# Altium schematic sheet arduino phc.SchDoc
size A3
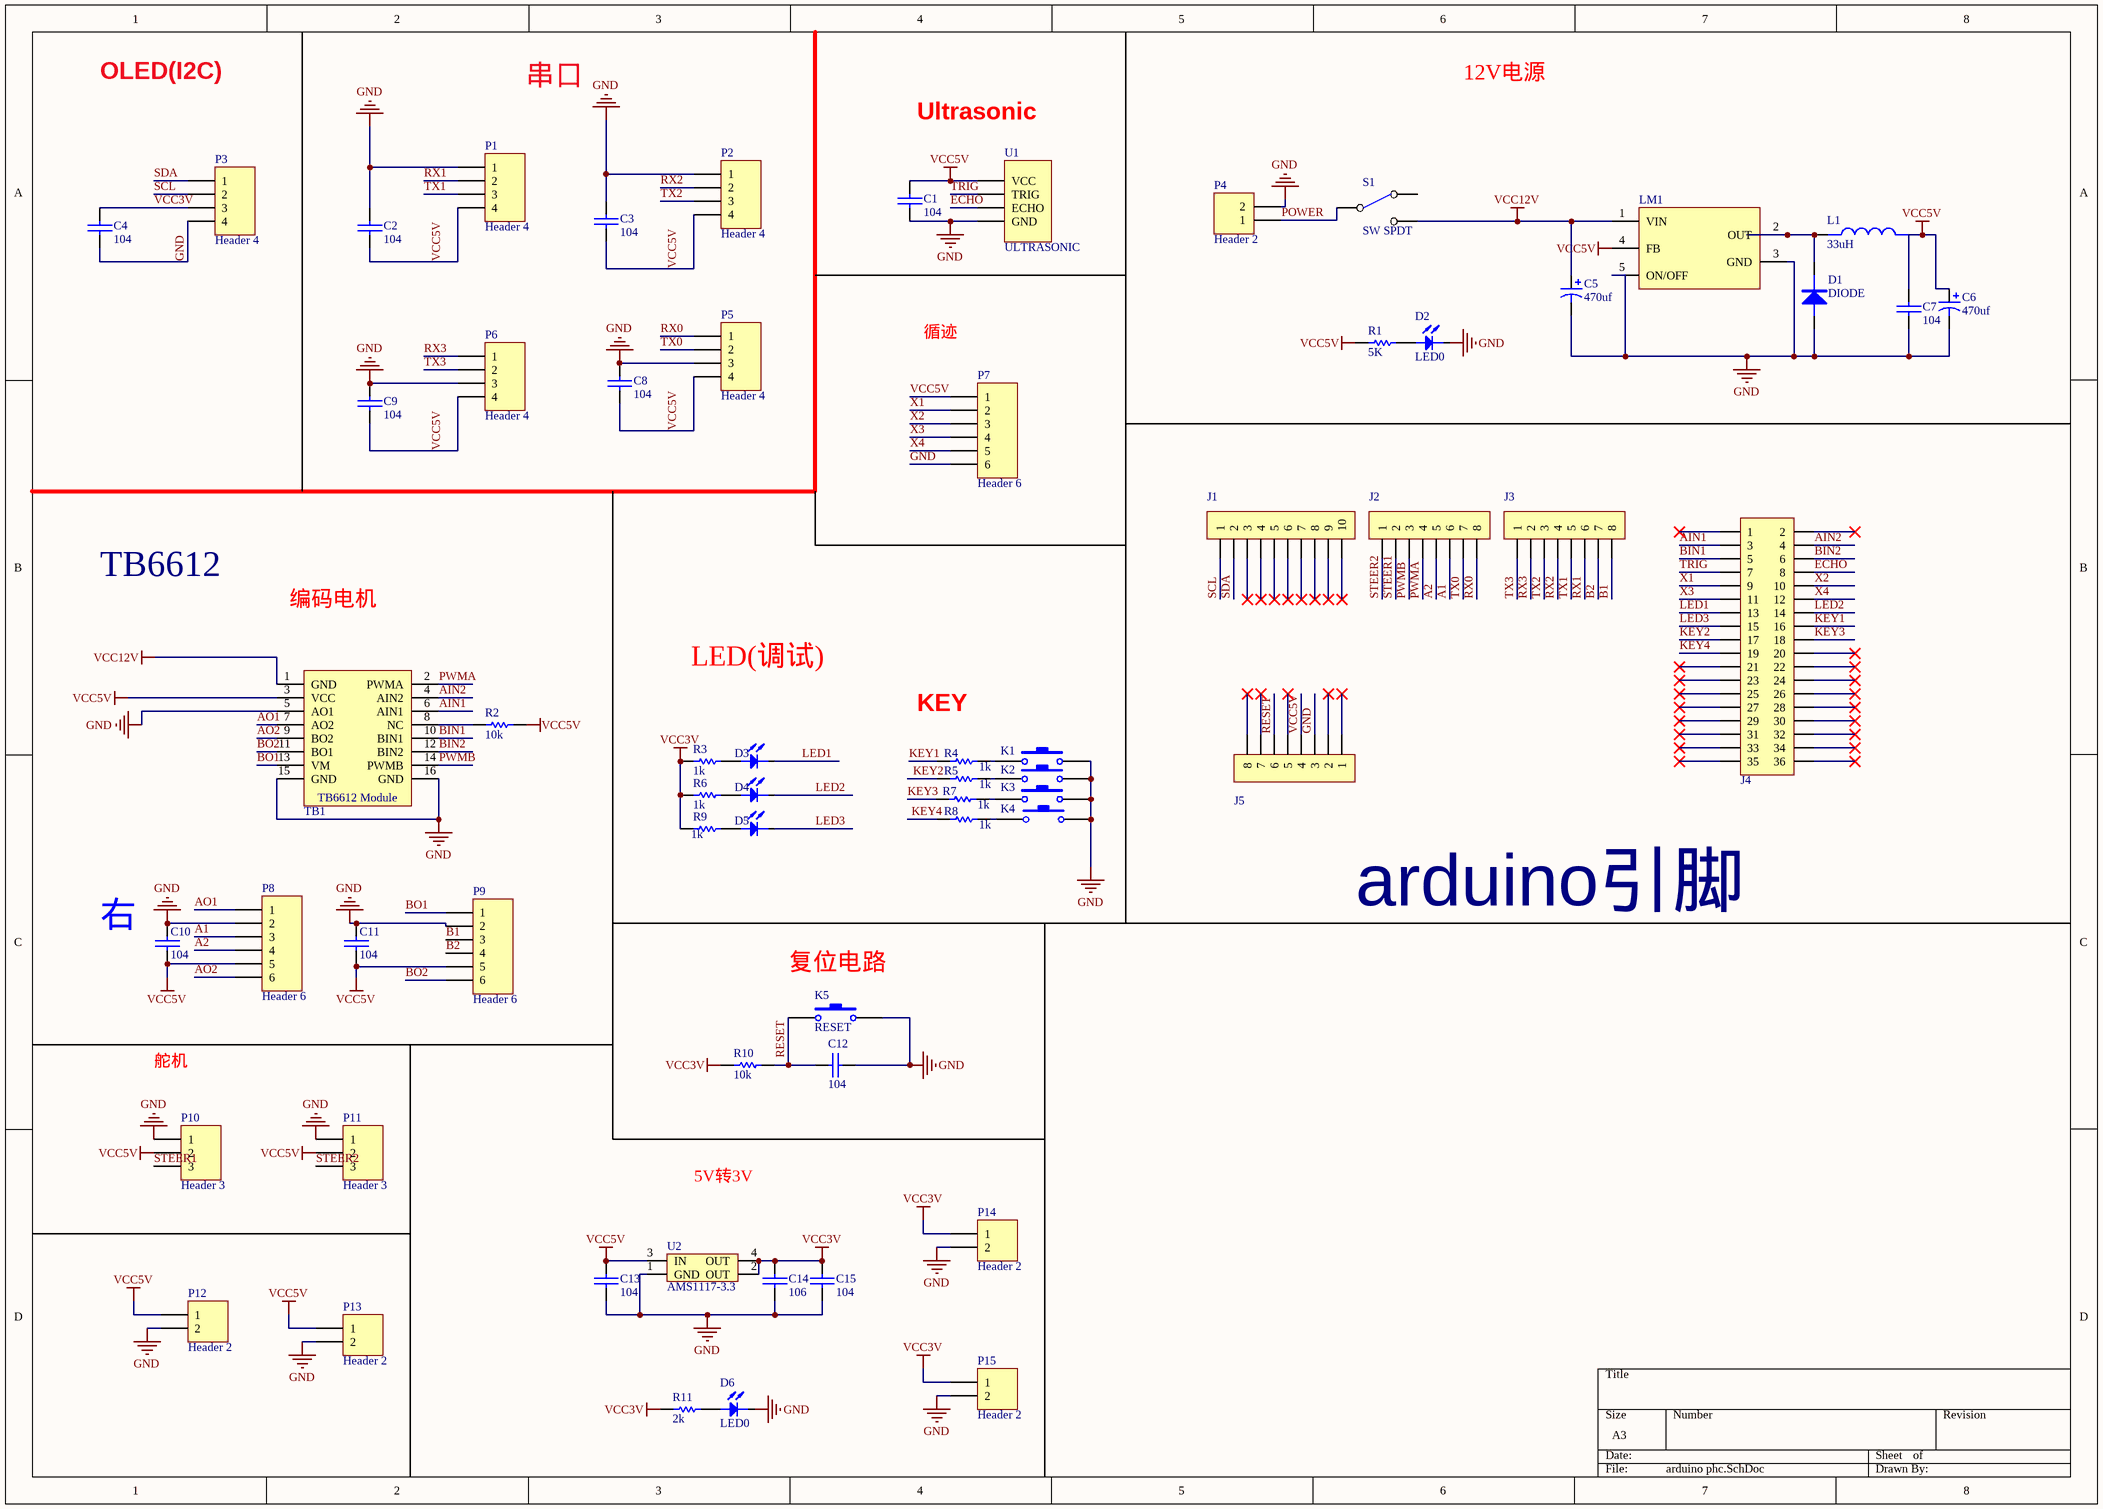
[diagram p0: arduino phc.SchDoc]

## Parts
C1  value 104  [0603_C]  (hidden comment: CAP)
C2  value 104  [0805_C]  (hidden comment: CAP)
C3  value 104  [0805_C]  (hidden comment: CAP)
C4  value 104  [0805_C]  (hidden comment: CAP)
C5  value 470uf  [CAP-8*16]  (hidden comment: CAP_HER)
C6  value 470uf  [CAP-8*16]  (hidden comment: CAP_HER)
C7  value 104  [0805_C]  (hidden comment: CAP)
C8  value 104  [0805_C]  (hidden comment: CAP)
C9  value 104  [0805_C]  (hidden comment: CAP)
C10  value 104  [0805_C]  (hidden comment: CAP)
C11  value 104  [0805_C]  (hidden comment: CAP)
C12  104  [0805_C]
C13  value 104  [0805_C]  (hidden comment: CAP)
C14  value 106  [0805_C]  (hidden comment: CAP)
C15  value 104  [0805_C]  (hidden comment: CAP)
D1  DIODE  [D1810]
D2  LED0  [0805-LED-RED]
D3  LED  [0805-LED-RED]  (value not drawn)
D4  LED  [0805-LED-RED]  (value not drawn)
D5  LED  [0805-LED-RED]  (value not drawn)
D6  LED0  [0805-LED-RED]
J1  HDR-1X10  [HDR2.54-LI-10P]  (value not drawn)
J2  HDR-1X8  [HDR2.54-LI-8P]  (value not drawn)
J3  HDR-1X8  [HDR2.54-LI-8P]  (value not drawn)
J4  Header 2X11  [HDR2.54-LI-2x18P]  (value not drawn)
J5  HDR-1X8  [HDR2.54-LI-8P]  (value not drawn)
K1  KEY2  [KEY-SMD]  (value not drawn)
K2  KEY2  [KEY-SMD]  (value not drawn)
K3  KEY3  [KEY-SMD]  (value not drawn)
K4  KEY3  [KEY-SMD]  (value not drawn)
K5  RESET  [KEY-SMD]
L1  33uH  [L_SOP74]
LM1  LM2596  [TO-263-5L]  (value not drawn)
P1  Header 4  [HDR1X4]
P2  Header 4  [HDR1X4]
P3  Header 4  [HDR1X4]
P4  Header 2  [DG1282-5.0]
P5  Header 4  [HDR1X4]
P6  Header 4  [HDR1X4]
P7  Header 6  [HDR1X6]
P8  Header 6  [XH2.54-WS-6P]
P9  Header 6  [XH2.54-WS-6P]
P10  Header 3  [HDR1X3]
P11  Header 3  [HDR1X3]
P12  Header 2  [HDR1X2]
P13  Header 2  [HDR1X2]
P14  Header 2  [HDR1X2]
P15  Header 2  [HDR1X2]
R1  5K  [0805_R]
R2  value 10k  [0805_R]  (hidden comment: RES)
R3  value 1k  [0805_R]  (hidden comment: RES)
R4  value 1k  [0805_R]  (hidden comment: RES)
R5  value 1k  [0805_R]  (hidden comment: RES)
R6  value 1k  [0805_R]  (hidden comment: RES)
R7  value 1k  [0805_R]  (hidden comment: RES)
R8  value 1k  [0805_R]  (hidden comment: RES)
R9  value 1k  [0805_R]  (hidden comment: RES)
R10  RES  [0805_R]  (value not drawn)
R11  value 2k  [0805_R]  (hidden comment: RES)
S1  SW SPDT  [SWITCH_3F_SPDT - 4.7mm]
TB1  TB6612 Module  [TB6612]  (value not drawn)
U1  ULTRASONIC  [HDR1X4]
U2  AMS1117-3.3  [SOT223_L]

## Nets
GND: C1.2 C2.1 C3.1 C4.2 C5.2 C6.2 C7.2 C8.1 C9.1 C10.1 C11.1 C12.2 C13.2 C14.2 C15.2 D1.a D2.K D6.K J5.3 K1.2 K2.2 K3.2 K4.2 K5.2 LM1.3(GND) LM1.5(ON/OFF) P1.1 P2.1 P3.4 P4.2 P5.3 P6.3 P7.6 P8.2 P9.2 P10.1 P11.1 P12.2 P13.2 P14.2 P15.2 TB1.5(AO1) TB1.15(GND) TB1.16(GND) U1.4(GND) U2.1(GND)
VCC3V: C4.1 C14.1 C15.1 P3.3 P14.1 P15.1 R3.1(BOT) R6.1(BOT) R9.1(BOT) R10.2(TOP) R11.1(BOT) U2.2(OUT) U2.4(OUT)
VCC5V: C1.1 C2.2 C3.2 C6.1 C7.1 C8.2 C9.2 C10.2 C11.2 C13.1 J5.4 L1.2(Pri-) LM1.4(FB) P1.4 P2.4 P5.4 P6.4 P7.1 P8.5 P9.5 P10.2 P11.2 P12.1 P13.1 R1.1(BOT) R2.1(BOT) TB1.3(VCC) U1.1(VCC) U2.3(IN)
VCC12V: C5.1 LM1.1(VIN) S1.3(NO) TB1.1(GND)
A1: J2.6 P8.3
A2: J2.5 P8.4
AIN1: J4.3 TB1.6(AIN1)
AIN2: J4.4 TB1.4(AIN2)
AO1: P8.1 TB1.7(AO2)
AO2: P8.6 TB1.9(BO2)
B1: J3.8 P9.3
B2: J3.7 P9.4
BIN1: J4.5 TB1.10(BIN1)
BIN2: J4.6 TB1.12(BIN2)
BO1: P9.1 TB1.13(VM)
BO2: P9.6 TB1.11(BO1)
ECHO: J4.8 U1.3(ECHO)
KEY1: J4.16 R4.1(BOT)
KEY2: J4.17 R5.1(BOT)
KEY3: J4.18 R7.1(BOT)
KEY4: J4.19 R8.1(BOT)
LED1: D3.K J4.13
LED2: D4.K J4.14
LED3: D5.K J4.15
POWER: P4.1 S1.2(COMMON)
PWMA: J2.4 TB1.2(PWMA)
PWMB: J2.3 TB1.14(PWMB)
RESET: C12.1 J5.6 K5.1 R10.1(BOT)
RX0: J2.8 P5.1
RX1: J3.6 P1.2
RX2: J3.4 P2.2
RX3: J3.2 P6.1
SCL: J1.1 P3.2
SDA: J1.2 P3.1
STEER1: J2.2 P10.3
STEER2: J2.1 P11.3
TRIG: J4.7 U1.2(TRIG)
TX0: J2.7 P5.2
TX1: J3.5 P1.3
TX2: J3.3 P2.3
TX3: J3.1 P6.2
X1: J4.9 P7.2
X2: J4.10 P7.3
X3: J4.11 P7.4
X4: J4.12 P7.5
NetD1_K: D1.K L1.1(Pri-) LM1.2(OUT)
NetD2_A: D2.A R1.2(TOP)
NetD3_A: D3.A R3.2(TOP)
NetD4_A: D4.A R6.2(TOP)
NetD5_A: D5.A R9.2(TOP)
NetD6_A: D6.A R11.2(TOP)
NetK1_1: K1.1 R4.2(TOP)
NetK2_1: K2.1 R5.2(TOP)
NetK3_1: K3.1 R7.2(TOP)
NetK4_1: K4.1 R8.2(TOP)
NetR2_2: R2.2(TOP) TB1.8(NC)

Not connected (* = marked no-connect by the designer): J1 3* 4* 5* 6* 7* 8* 9* 10*; J4 1* 2* 20* 21* 22* 23* 24* 25* 26* 27* 28* 29* 30* 31* 32* 33* 34* 35* 36*; J5 1* 2* 5* 7* 8*; S1 1(NC)

## Notes on the sheet
- OLED(I2C)
- 串口
- 12V电源
- Ultrasonic
- 循迹
- TB6612
- 编码电机
- LED(调试)
- KEY
- arduino引脚
- (near C10) 右
- (near K5) 复位电路
- 舵机
- 5V转3V
- (in symbol RES) 10k

## Library data of the parts
C12 = CAP: Value: 104
D2 D6 = LED
J1 = Header 10: 10P接插件; 封装库来自淘宝卖家 ID：黄晶宝石: 其他店铺购入均为盗版假冒封装库; 联系卖家，免费查找封装: 唯一出售店铺网址https://shop463601444.taobao.com; BOM名称: 10P接插件
J2 J3 J5 = Header 8: 8P接插件; 封装库来自淘宝卖家 ID：黄晶宝石: 其他店铺购入均为盗版假冒封装库; 联系卖家，免费查找封装: 唯一出售店铺网址https://shop463601444.taobao.com; BOM名称: 8P接插件
J4 = Header 18X2: 18*2P接插件; 封装库来自淘宝卖家 ID：黄晶宝石: 其他店铺购入均为盗版假冒封装库; 联系卖家，免费查找封装: 唯一出售店铺网址https://shop463601444.taobao.com; BOM名称: 18*2P接插件
K1-K5 = KEY
L1 = IND
LM1 = LM2596: LM2576
P1-P3 P5 P6 = Header 4: Header, 4-Pin; LatestRevisionDate: 17-Jul-2002; LatestRevisionNote: Re-released for DXP Platform.; Publisher: Altium Limited
P4 P12-P15 = Header 2: Header, 2-Pin; LatestRevisionDate: 17-Jul-2002; LatestRevisionNote: Re-released for DXP Platform.; Publisher: Altium Limited
P7-P9 = Header 6: Header, 6-Pin; LatestRevisionDate: 17-Jul-2002; LatestRevisionNote: Re-released for DXP Platform.; Publisher: Altium Limited
P10 P11 = Header 3: Header, 3-Pin; LatestRevisionDate: 17-Jul-2002; LatestRevisionNote: Re-released for DXP Platform.; Publisher: Altium Limited
R1 = RES_1
U1 = ULTRASONIC: Header, 4-Pin; LatestRevisionDate: 17-Jul-2002; LatestRevisionNote: Re-released for DXP Platform.; Publisher: Altium Limited
U2 = AMS1117
TB1 = TB6612 Module: LatestRevisionDate: 17-Jul-2002; LatestRevisionNote: Re-released for DXP Platform.; Publisher: Altium Limited